# EAGLE design Bus Hijack Board (EAGLE 5.12)
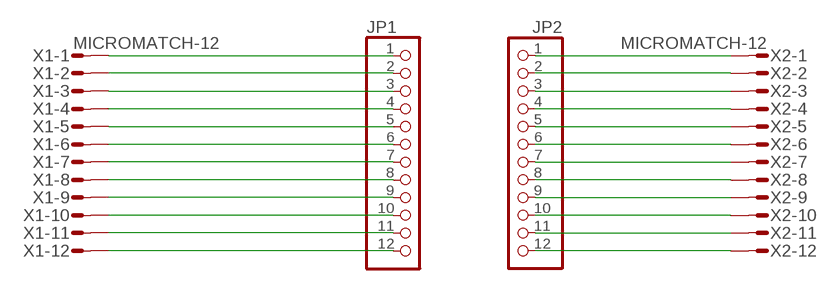
[diagram p0: schematic, sheet 1]

## Parts
JP1  PINHD-1X12  [1X12]
JP2  PINHD-1X12  [1X12]
X1  MICROMATCH-12  [MICROMATCH-12]
X2  MICROMATCH-12  [MICROMATCH-12]

## Nets
N$1: JP1.1 X1.1
N$2: JP1.2 X1.2
N$3: JP1.3 X1.3
N$4: JP1.4 X1.4
N$5: JP1.5 X1.5
N$6: JP1.6 X1.6
N$7: JP1.7 X1.7
N$8: JP1.8 X1.8
N$9: JP1.9 X1.9
N$10: JP1.10 X1.10
N$11: JP1.11 X1.11
N$12: JP1.12 X1.12
N$13: JP2.1 X2.1
N$14: JP2.2 X2.2
N$15: JP2.3 X2.3
N$16: JP2.4 X2.4
N$17: JP2.5 X2.5
N$18: JP2.6 X2.6
N$19: JP2.7 X2.7
N$20: JP2.8 X2.8
N$21: JP2.9 X2.9
N$22: JP2.10 X2.10
N$23: JP2.11 X2.11
N$24: JP2.12 X2.12

## Library data of the parts
JP1 JP2 = pinhead:PINHD-1X12: PIN HEADER
X1 X2 = con-amp-micromatch:MICROMATCH-12: MicroMaTch 12 8-215464-2 / 1-215464-2 Drawing Number C-215464 DDEController.pdf; MF: FARNELL; MPN: 8-215464-2; OC_FARNELL: 3784666; OC_NEWARK: 95H9857

## Board
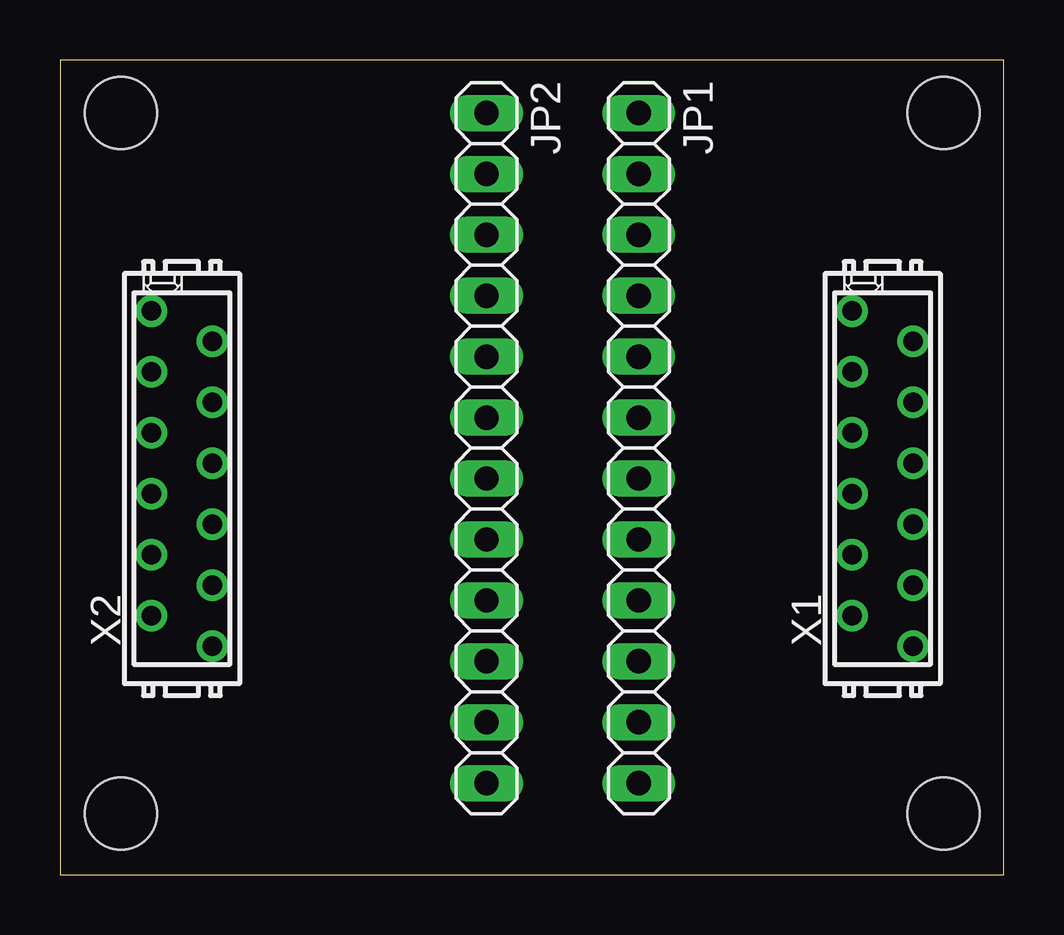
[diagram p1: board, top side]
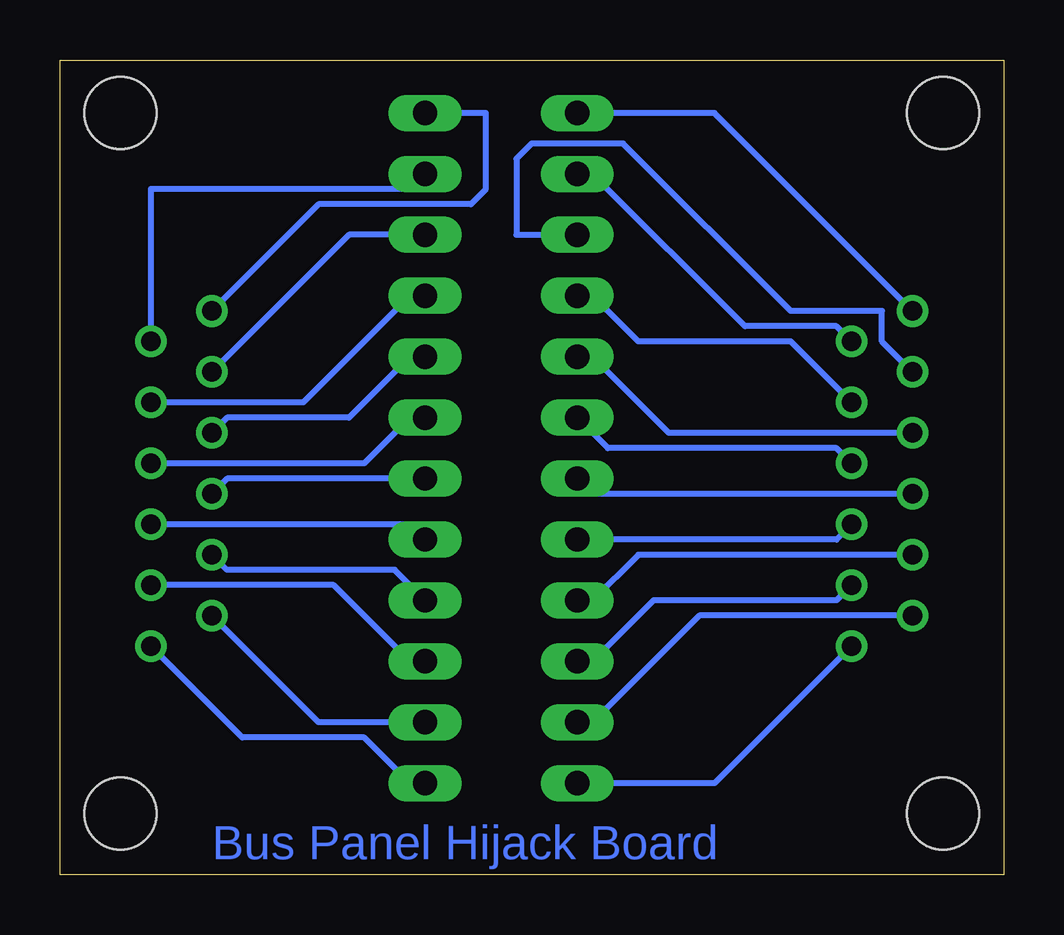
[diagram p2: board, bottom side, seen from below]

Size 39.35 x 33.96 mm. Coordinates in mm from the lower left corner, seen from the top.
Outline: 0,0 39.35,0 39.35,33.96 0,33.96 0,0
Copper layers (1*16): Top 0.035mm / dielectric 1.5mm / Bottom 0.035mm
Design rules "default *": minimum track width 10mil, minimum drill 24mil, track to track 8mil, track to pad 8mil, pad to pad 8mil, via to via 8mil, smd to smd 8mil, copper to edge 40mil, drill to drill 10mil, minimum pad ring 10mil, minimum via ring 8mil, stop-mask expansion 4mil, vias tented up to drill 0mil, thermal gap 10mil
Holes 3 mm at 2.54,31.75 2.54,2.54 36.83,2.54 36.83,31.75

### Footprints (pad centres in the part's own frame; a part is rotated, then mirrored left to right if it is on the bottom)
1X12 = drill 1.016 long: 1 -13.97,0; 2 -11.43,0; 3 -8.89,0; 4 -6.35,0; 5 -3.81,0; 6 -1.27,0; 7 1.27,0; 8 3.81,0; 9 6.35,0; 10 8.89,0; 11 11.43,0; 12 13.97,0
MICROMATCH-12 = drill 0.813 round: 1 6.985,1.27; 2 5.715,-1.27; 3 4.445,1.27; 4 3.175,-1.27; 5 1.905,1.27; 6 0.635,-1.27; 7 -0.635,1.27; 8 -1.905,-1.27; 9 -3.175,1.27; 10 -4.445,-1.27; 11 -5.715,1.27; 12 -6.985,-1.27

### Placement (x,y rotation side)
JP1  24.13,17.78 270 top
JP2  17.78,17.78 270 top
X1  34.29,16.51 90 top
X2  5.08,16.51 90 top

### Tracks (layer width: path | path; a pad name or v marks a point on that pad's centre or on a via)
N$1
  Bottom 0.254: X1.1 28.57,27.94 22.23,27.94 21.59,28.57 21.59,31.75 JP1.1
N$2
  Bottom 0.254: X1.2 35.56,28.57 24.77,28.57 JP1.2
N$3
  Bottom 0.254: X1.3 27.3,26.67 JP1.3
N$4
  Bottom 0.254: X1.4 29.21,19.68 24.77,24.13 JP1.4
N$5
  Bottom 0.254: X1.5 32.38,19.05 27.3,19.05 24.77,21.59 JP1.5
N$6
  Bottom 0.254: X1.6 26.67,17.14 24.77,19.05 JP1.6
N$7
  Bottom 0.254: X1.7 32.38,16.51 JP1.7
N$8
  Bottom 0.254: X1.8 24.77,14.6 JP1.8
N$9
  Bottom 0.254: X1.9 32.38,12.7 25.4,12.7 JP1.9
N$10
  Bottom 0.254: X1.10 27.94,12.06 24.77,8.89 JP1.10
N$11
  Bottom 0.254: X1.11 28.57,6.35 JP1.11
N$12
  Bottom 0.254: X1.12 31.75,5.71 26.67,5.71 24.77,3.81 JP1.12
N$13
  Bottom 0.254: X2.1 12.06,31.75 JP2.1
N$14
  Bottom 0.254: X2.2 6.99,22.86 10.79,22.86 17.14,29.21 JP2.2
N$15
  Bottom 0.254: X2.3 5.08,22.22 5.08,23.49 8.89,23.49 15.88,30.48 19.68,30.48 20.32,29.84 20.32,26.67 JP2.3
N$16
  Bottom 0.254: X2.4 8.89,22.22 15.24,22.22 17.14,24.13 JP2.4
N$17
  Bottom 0.254: X2.5 13.97,18.41 17.14,21.59 JP2.5
N$18
  Bottom 0.254: X2.6 6.99,17.78 16.51,17.78 JP2.6
N$19
  Bottom 0.254: X2.7 17.14,15.88 JP2.7
N$20
  Bottom 0.254: X2.8 6.99,13.97 JP2.8
N$21
  Bottom 0.254: X2.9 15.24,13.33 17.14,11.43 JP2.9
N$22
  Bottom 0.254: X2.10 6.99,11.43 14.61,11.43 17.14,8.89 JP2.10
N$23
  Bottom 0.254: X2.11 12.7,10.79 17.14,6.35 JP2.11
N$24
  Bottom 0.254: X2.12 12.06,3.81 JP2.12

### Text on the board
Bottom: Bus Panel Hijack Board